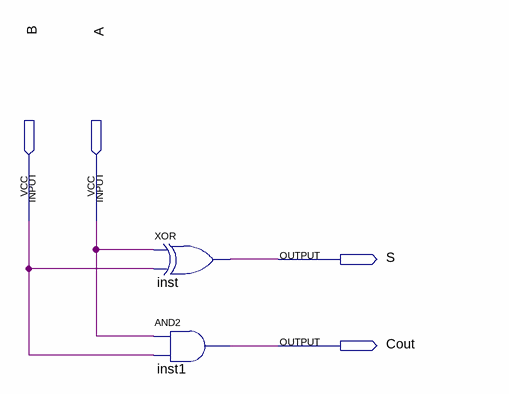
[diagram p0: schematic sheet]
// Quartus schematic ha.bdf as structural Verilog: 2 symbols, 4 pins
module ha (
  input  B,
  input  A,
  output S,
  output Cout
);

  xor inst (S, A, B);
  and inst1 (Cout, A, B);
endmodule
